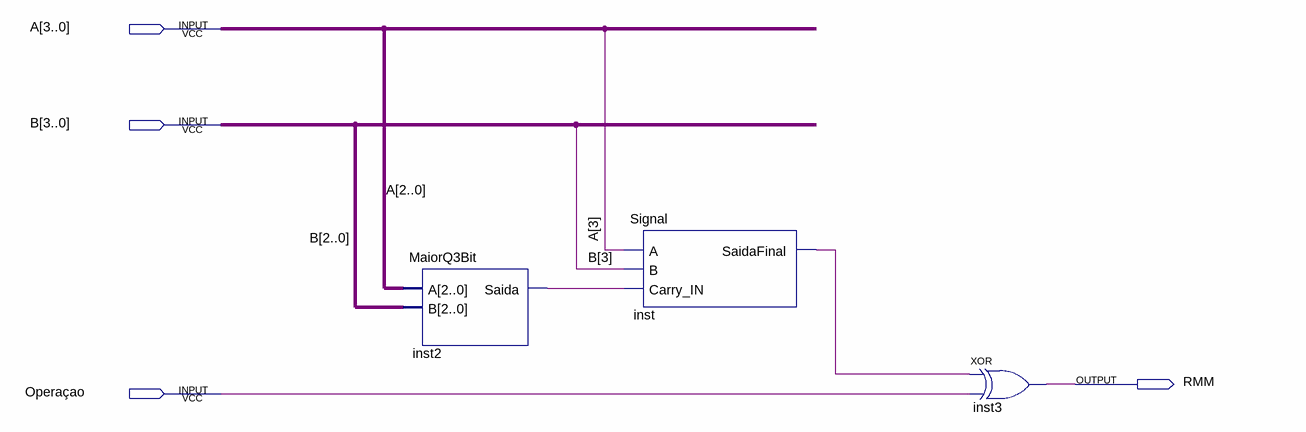
[diagram p0: schematic sheet]
// Quartus schematic Maior_Menor.bdf as structural Verilog: 3 symbols, 4 pins
module Maior_Menor (
  input  [3:0] A,
  input  [3:0] B,
  input  \Operaçao ,
  output RMM
);

  wire inst2_saida, inst_saidafinal;

  MaiorQ3Bit inst2 (.A(A[2:0]), .B(B[2:0]), .Saida(inst2_saida));
  Signal inst (.A(A[3]), .Carry_IN(inst2_saida), .B(B[3]), .SaidaFinal(inst_saidafinal));
  xor inst3 (RMM, inst_saidafinal, \Operaçao );
endmodule
